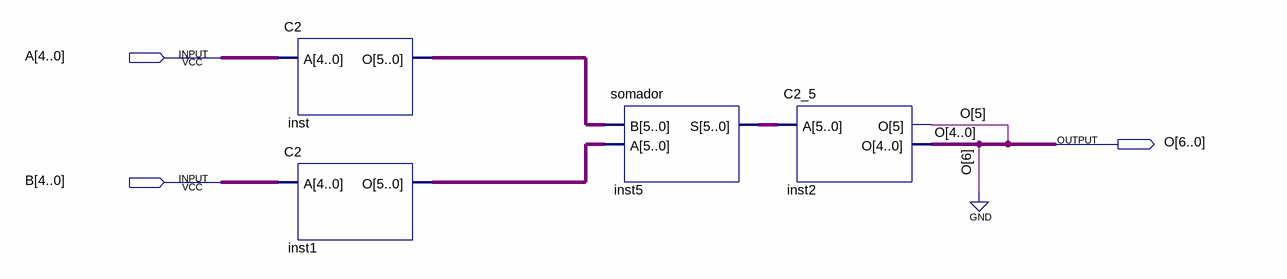
[diagram p0: schematic sheet]
// Quartus schematic soma.bdf as structural Verilog: 4 symbols, 3 pins
module soma (
  input  [4:0] A,
  input  [4:0] B,
  output [6:0] O
);

  wire [5:0] inst1_o, inst5_s, inst_o;

  C2 inst (.A(A), .O(inst_o));
  C2 inst1 (.A(B), .O(inst1_o));
  somador inst5 (.B(inst_o), .A(inst1_o), .S(inst5_s));
  C2_5 inst2 (.A(inst5_s), .O(O[5:0]));

  assign O[6] = 1'b0;
endmodule
